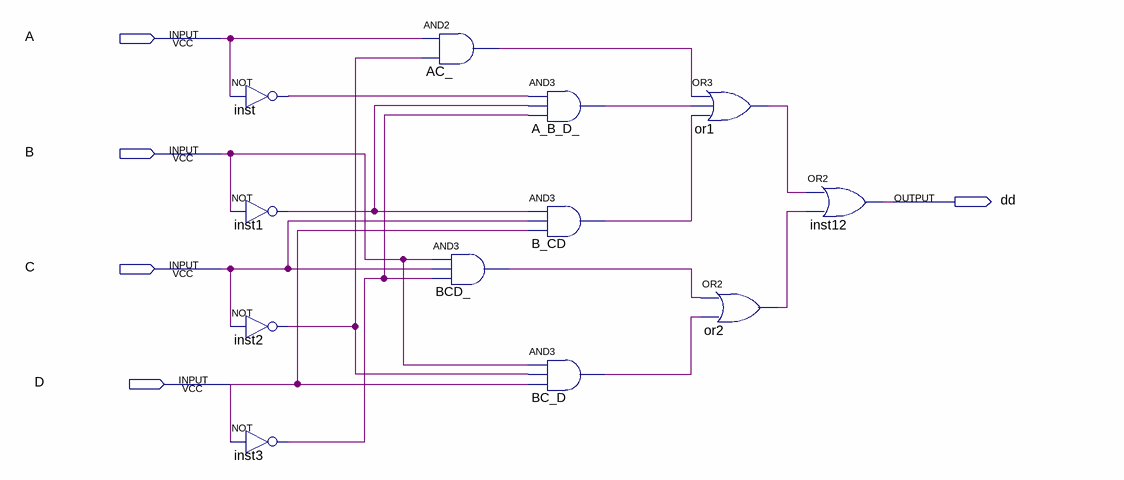
[diagram p0: schematic sheet]
// Quartus schematic output_d.bdf as structural Verilog: 12 symbols, 5 pins
module output_d (
  input  A,
  input  B,
  input  C,
  input  D,
  output dd
);

  wire A_B_D__out, AC__out, B_CD_out, BC_D_out, BCD__out, inst1_out, inst2_out, inst3_out, inst_out, or1_out,
       or2_out;

  not inst (inst_out, A);
  not inst1 (inst1_out, B);
  not inst2 (inst2_out, C);
  not inst3 (inst3_out, D);
  and AC_ (AC__out, A, inst2_out);
  and BCD_ (BCD__out, B, C, inst3_out);
  and A_B_D_ (A_B_D__out, inst_out, inst1_out, inst3_out);
  and B_CD (B_CD_out, inst1_out, C, D);
  and BC_D (BC_D_out, B, inst2_out, D);
  or or1 (or1_out, AC__out, A_B_D__out, B_CD_out);
  or or2 (or2_out, BCD__out, BC_D_out);
  or inst12 (dd, or1_out, or2_out);
endmodule
